# EAGLE design commander (EAGLE 5.03)
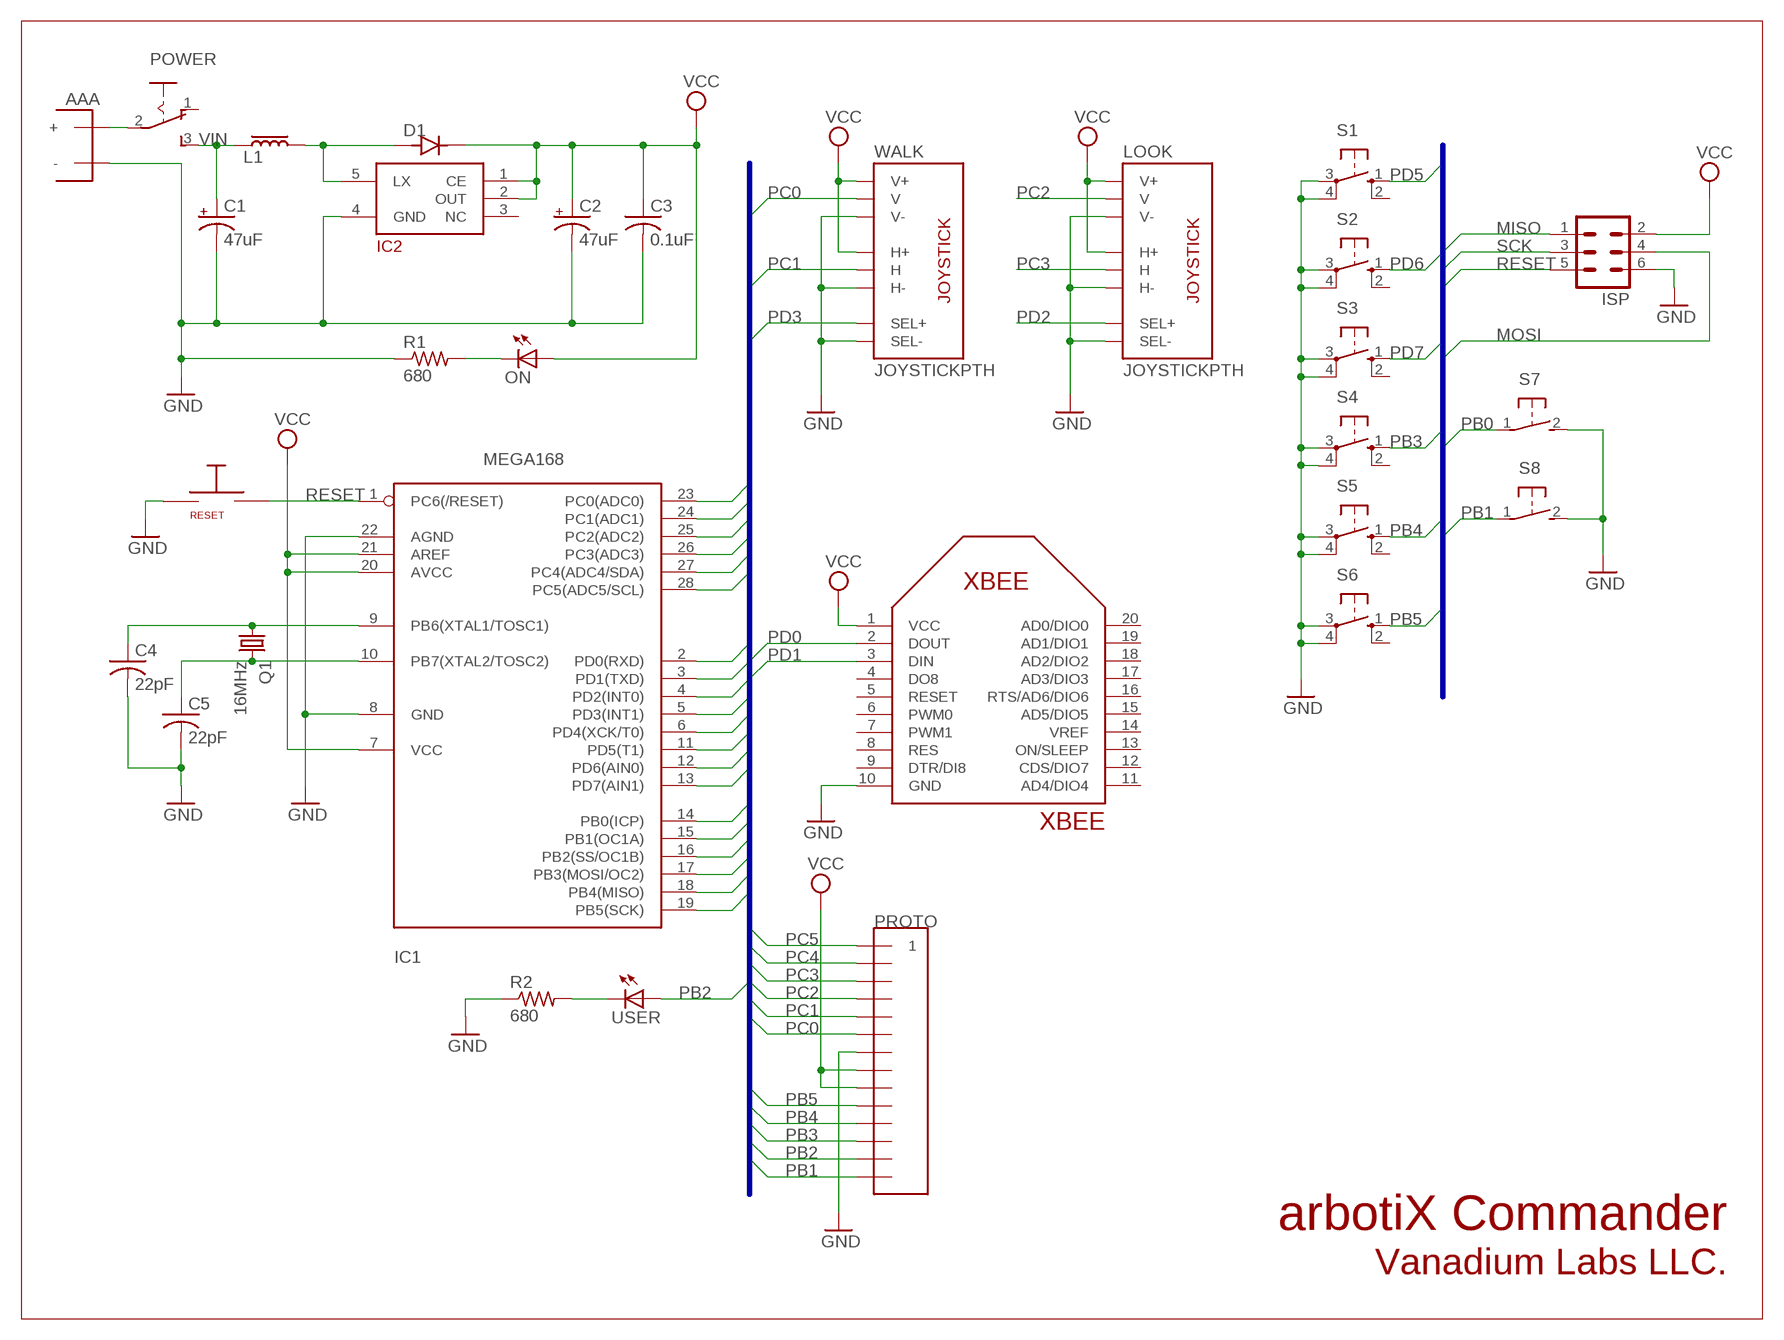
[diagram p0: schematic, sheet 1]

## Parts
C1  47uF  CPOL-USTT2D5  [TT2D5]
C2  47uF  CPOL-USTT2D5  [TT2D5]
C3  0.1uF  C-US025-024X044  [C025-024X044]
C4  22pF  C-US025-024X044  [C025-024X044]
C5  22pF  C-US025-024X044  [C025-024X044]
D1  DFLS130  [POWERDI123]
IC1  MEGA168  MEGA8-P  [DIL28-3]
IC2  NCP1402  [SOT-23-5]
ISP  MA03-2  [MA03-2]
L1  811-1293-ND  [2200R]
LOOK  JOYSTICKPTH  [JOYSTICK]
ON  LED3MM  [LED3MM]
POWER  M251  [M251]
Q1  16MHz  HC49/S  [HC49/S]
R1  680  R-US_0204/7  [0204/7]
R2  680  R-US_0204/7  [0204/7]
RESET  400-1646-ND  [MINISW]
S1  10-XX  [B3F-10XX]
S2  10-XX  [B3F-10XX]
S3  10-XX  [B3F-10XX]
S4  10-XX  [B3F-10XX]
S5  10-XX  [B3F-10XX]
S6  10-XX  [B3F-10XX]
S7  31-XX  [B3F-31XX]
S8  31-XX  [B3F-31XX]
U$1  HEADER14  [1X14]
U$2  AAA  [AAA]
USER  LED3MM  [LED3MM]
WALK  JOYSTICKPTH  [JOYSTICK]
XBEE  XBEE  [XBEE]

## Nets
GND: C1.- C2.- C3.2 C4.2 C5.2 IC1.8(GND) IC1.22(AGND) IC2.4(GND) ISP.6 LOOK.B2A(SEL-) LOOK.H3(H-) LOOK.V3(V-) R1.1 R2.1 RESET.2 S1.3(P) S1.4(P1) S2.3(P) S2.4(P1) S3.3(P) S3.4(P1) S4.3(P) S4.4(P1) S5.3(P) S5.4(P1) S6.3(P) S6.4(P1) S7.2(S) S8.2(S) U$1.P$7 U$2.P$2(-) WALK.B2A(SEL-) WALK.H3(H-) WALK.V3(V-) XBEE.10(GND)
N$3: ON.K(C) R1.2
N$6: C4.1 IC1.9(PB6(XTAL1/TOSC1)) Q1.1
N$7: C5.1 IC1.10(PB7(XTAL2/TOSC2)) Q1.2
N$55: D1.ANODE IC2.5(LX) L1.P$2
N$56: POWER.2(P) U$2.P$1(+)
PB0: IC1.14(PB0(ICP)) S7.1(P)
PB1: IC1.15(PB1(OC1A)) S8.1(P) U$1.P$14
PB2: IC1.16(PB2(SS/OC1B)) U$1.P$13 USER.A
PB3: IC1.17(PB3(MOSI/OC2)) ISP.4 S4.1(S) U$1.P$12
PB4: IC1.18(PB4(MISO)) ISP.1 S5.1(S) U$1.P$11
PB5: IC1.19(PB5(SCK)) ISP.3 S6.1(S) U$1.P$10
PC0: IC1.23(PC0(ADC0)) U$1.P$6 WALK.V2(V)
PC1: IC1.24(PC1(ADC1)) U$1.P$5 WALK.H2(H)
PC2: IC1.25(PC2(ADC2)) LOOK.V2(V) U$1.P$4
PC3: IC1.26(PC3(ADC3)) LOOK.H2(H) U$1.P$3
PC4: IC1.27(PC4(ADC4/SDA)) U$1.P$2
PC5: IC1.28(PC5(ADC5/SCL)) U$1.P$1
PD0: IC1.2(PD0(RXD)) XBEE.2(DOUT)
PD1: IC1.3(PD1(TXD)) XBEE.3(DIN)
PD2: IC1.4(PD2(INT0)) LOOK.B1A(SEL+)
PD3: IC1.5(PD3(INT1)) WALK.B1A(SEL+)
PD4: IC1.6(PD4(XCK/T0))
PD5: IC1.11(PD5(T1)) S1.1(S)
PD6: IC1.12(PD6(AIN0)) S2.1(S)
PD7: IC1.13(PD7(AIN1)) S3.1(S)
RESET: IC1.1(PC6(/RESET)) ISP.5 RESET.1
USER: R2.2 USER.K(C)
VCC: C2.+ C3.1 D1.CATHODE IC1.7(VCC) IC1.20(AVCC) IC1.21(AREF) IC2.1(CE) IC2.2(OUT) ISP.2 LOOK.H1(H+) LOOK.V1(V+) ON.A U$1.P$8 U$1.P$9 WALK.H1(H+) WALK.V1(V+) XBEE.1(VCC)
VIN: C1.+ L1.P$1 POWER.3(S)
Unconnected: IC2.3(NC) POWER.1(O) S1.2(S1) S2.2(S1) S3.2(S1) S4.2(S1) S5.2(S1) S6.2(S1) XBEE.4(DO8) XBEE.5(RESET) XBEE.6(PWM0) XBEE.7(PWM1) XBEE.8(RES) XBEE.9(DTR/DI8) XBEE.11(AD4/DIO4) XBEE.12(CDS/DIO7) XBEE.13(ON/SLEEP) XBEE.14(VREF) XBEE.15(AD5/DIO5) XBEE.16(RTS/AD6/DIO6) XBEE.17(AD3/DIO3) XBEE.18(AD2/DIO2) XBEE.19(AD1/DIO1) XBEE.20(AD0/DIO0)

## Buses
PB[0..5],PC[0..5],PD[0..7],RESET

## Notes on the sheet
- AAA
- MISO
- SCK
- MOSI
- PROTO
- arbotiX Commander
- Vanadium Labs LLC.

## Library data of the parts
C1 C2 = rcl:CPOL-US: POLARIZED CAPACITOR, American symbol
C3-C5 = rcl:C-US: CAPACITOR, American symbol
D1 = robots:DFLS130
IC1 = avr:MEGA8-P: MICROCONTROLLER 8 Kbytes FLASH 1 kbytes SRAM 512 bytes EEPROM USART 4-channel 10 bit ADC 2-channel 8 bit ADC
IC2 = robots:NCP1402
ISP = con-lstb:MA03-2: PIN HEADER
L1 = robots:811-1293-ND
LOOK WALK = SparkFun:JOYSTICK: Thumb Joystick Joystick commonly found in PS2 controllers. Two pots and a select switch. Footprint proven. Spark Fun Electronics SKU : COM-09032
ON USER = led:LED: LED OSRAM: - CHIPLED LG R971, LG N971, LY N971, LG Q971, LY Q971, LO R971, LY R971 LH N974, LH R974 LS Q976, LO Q976, LY Q976 LO Q996 - Hyper CHIPLED LW Q18S LB Q993, LB Q99A, LB R99A - SideLED LS A670, LO A670, LY A670, LG A670, LP A670 LB A673, LV A673, LT A673, LW A673 LH A674 LY A675 LS A676, LA A676, LO A676, LY A676, LW A676 LS A679, LY A679, LG A679 - Hyper Micro SIDELED® LS Y876, LA Y876, LO Y876, LY Y876 LT Y87S - SmartLED LW L88C, LW L88S LB L89C, LB L89S, LG L890 LS L89K, LO L89K, LY L89K LS L896, LA L896, LO L896, LY L896 - TOPLED LS T670, LO T670, LY T670, LG T670, LP T670 LSG T670, LSP T670, LSY T670, LOP T670, LYG T670 LG T671, LOG T671, LSG T671 LB T673, LV T673, LT T673, LW T673 LH T674 LS T676, LA T676, LO T676, LY T676, LB T676, LH T676, LSB T676, LW T676 LB T67C, LV T67C, LT T67C, LS T67K, LO T67K, LY T67K, LW E67C LS E67B, LA E67B, LO E67B, LY E67B, LB E67C, LV E67C, LT E67C LW T67C LS T679, LY T679, LG T679 LS T770, LO T770, LY T770, LG T770, LP T770 LB T773, LV T773, LT T773, LW T773 LH T774 LS E675, LA E675, LY E675, LS T675 LS T776, LA T776, LO T776, LY T776, LB T776 LHGB T686 LT T68C, LB T68C - Hyper Mini TOPLED® LB M676 - Mini TOPLED Santana® LG M470 LS M47K, LO M47K, LY M47K Source: http://www.osram.convergy.de LUXEON: - LUMILED® LXK2-PW12-R00, LXK2-PW12-S00, LXK2-PW14-U00, LXK2-PW14-V00 LXK2-PM12-R00, LXK2-PM12-S00, LXK2-PM14-U00 LXK2-PE12-Q00, LXK2-PE12-R00, LXK2-PE12-S00, LXK2-PE14-T00, LXK2-PE14-U00 LXK2-PB12-K00, LXK2-PB12-L00, LXK2-PB12-M00, LXK2-PB14-N00, LXK2-PB14-P00, LXK2-PB14-Q00 LXK2-PR12-L00, LXK2-PR12-M00, LXK2-PR14-Q00, LXK2-PR14-R00 LXK2-PD12-Q00, LXK2-PD12-R00, LXK2-PD12-S00 LXK2-PH12-R00, LXK2-PH12-S00 LXK2-PL12-P00, LXK2-PL12-Q00, LXK2-PL12-R00 Source: www.luxeon.com KINGBRIGHT: KA-3528ASYC Source: www.kingbright.com
POWER = switch:M251: SLIDING SWITCH Mors, distributor Buerklin, 11G702
Q1 = crystal:HC49/S: CRYSTAL
R1 R2 = rcl:R-US_: RESISTOR, American symbol
RESET = robots:400-1646-ND: Mini Switch
S1-S6 = switch-omron:10-XX: OMRON SWITCH
S7 S8 = switch-omron:31-XX: OMRON SWITCH
U$1 = robots:HEADER14
U$2 = robots:AAA
XBEE = robots:XBEE

## Board
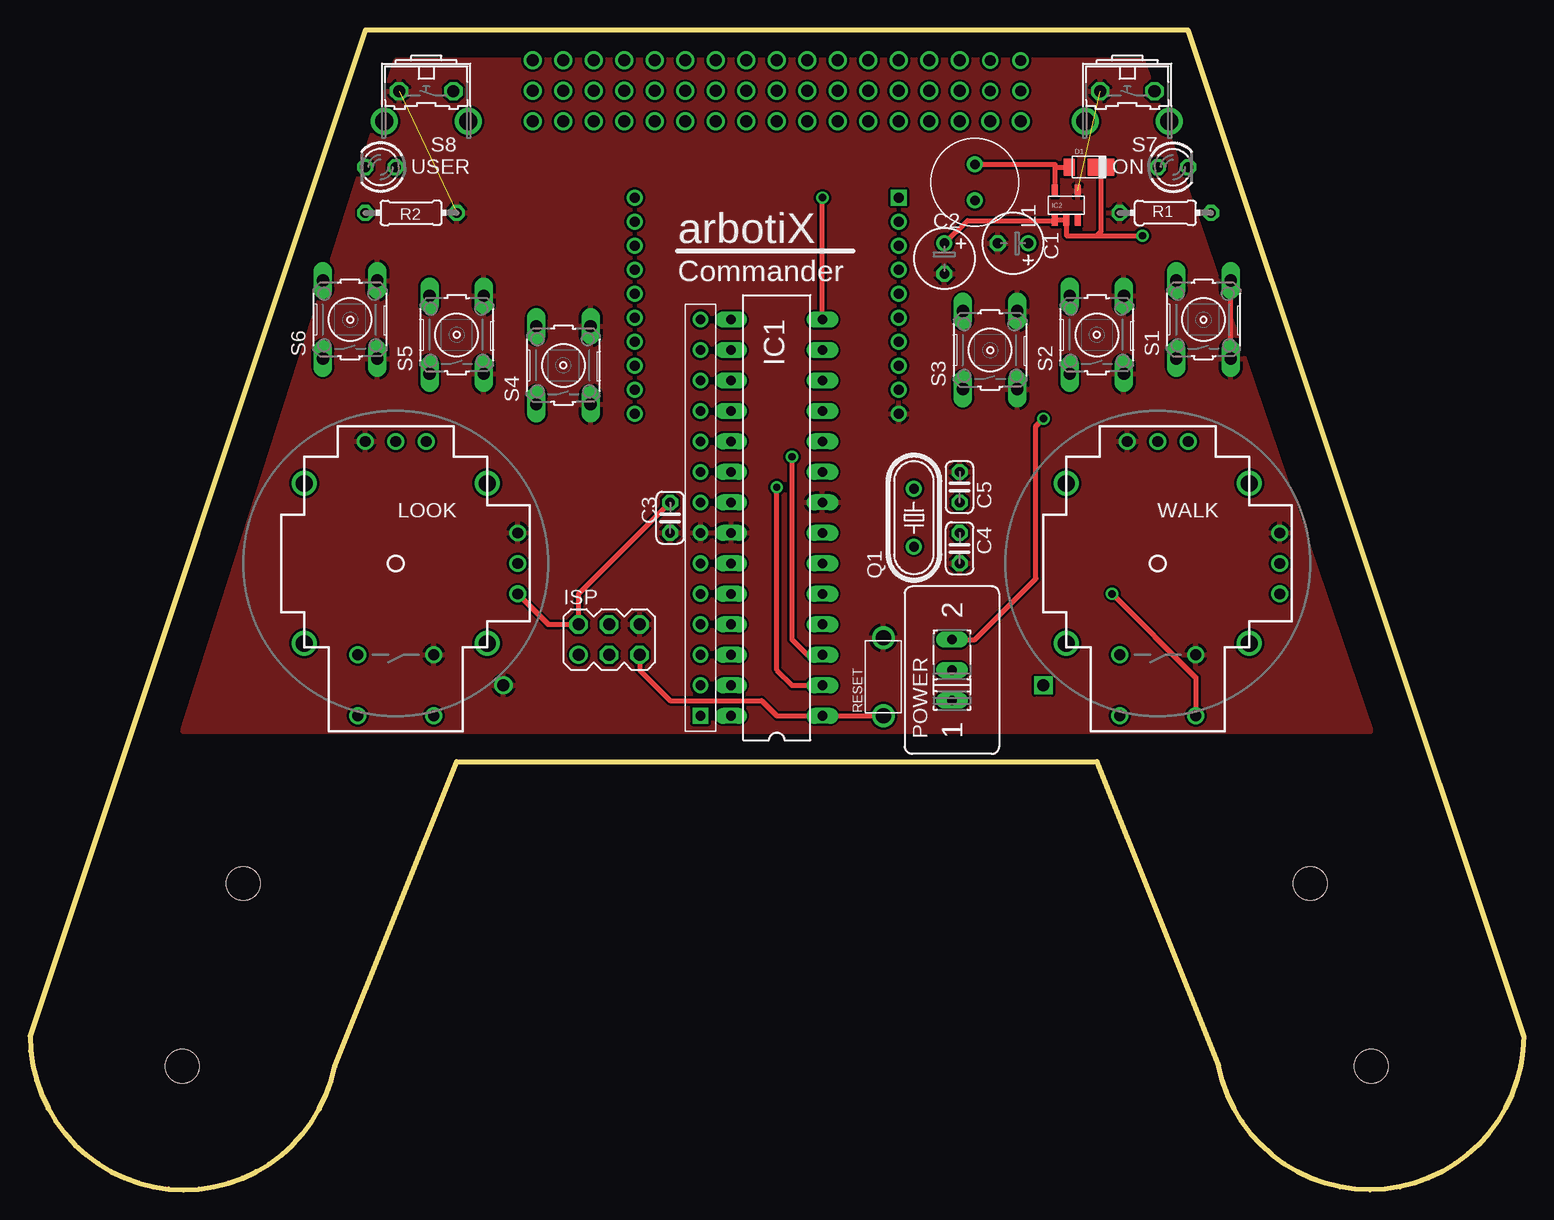
[diagram p1: board, top side]
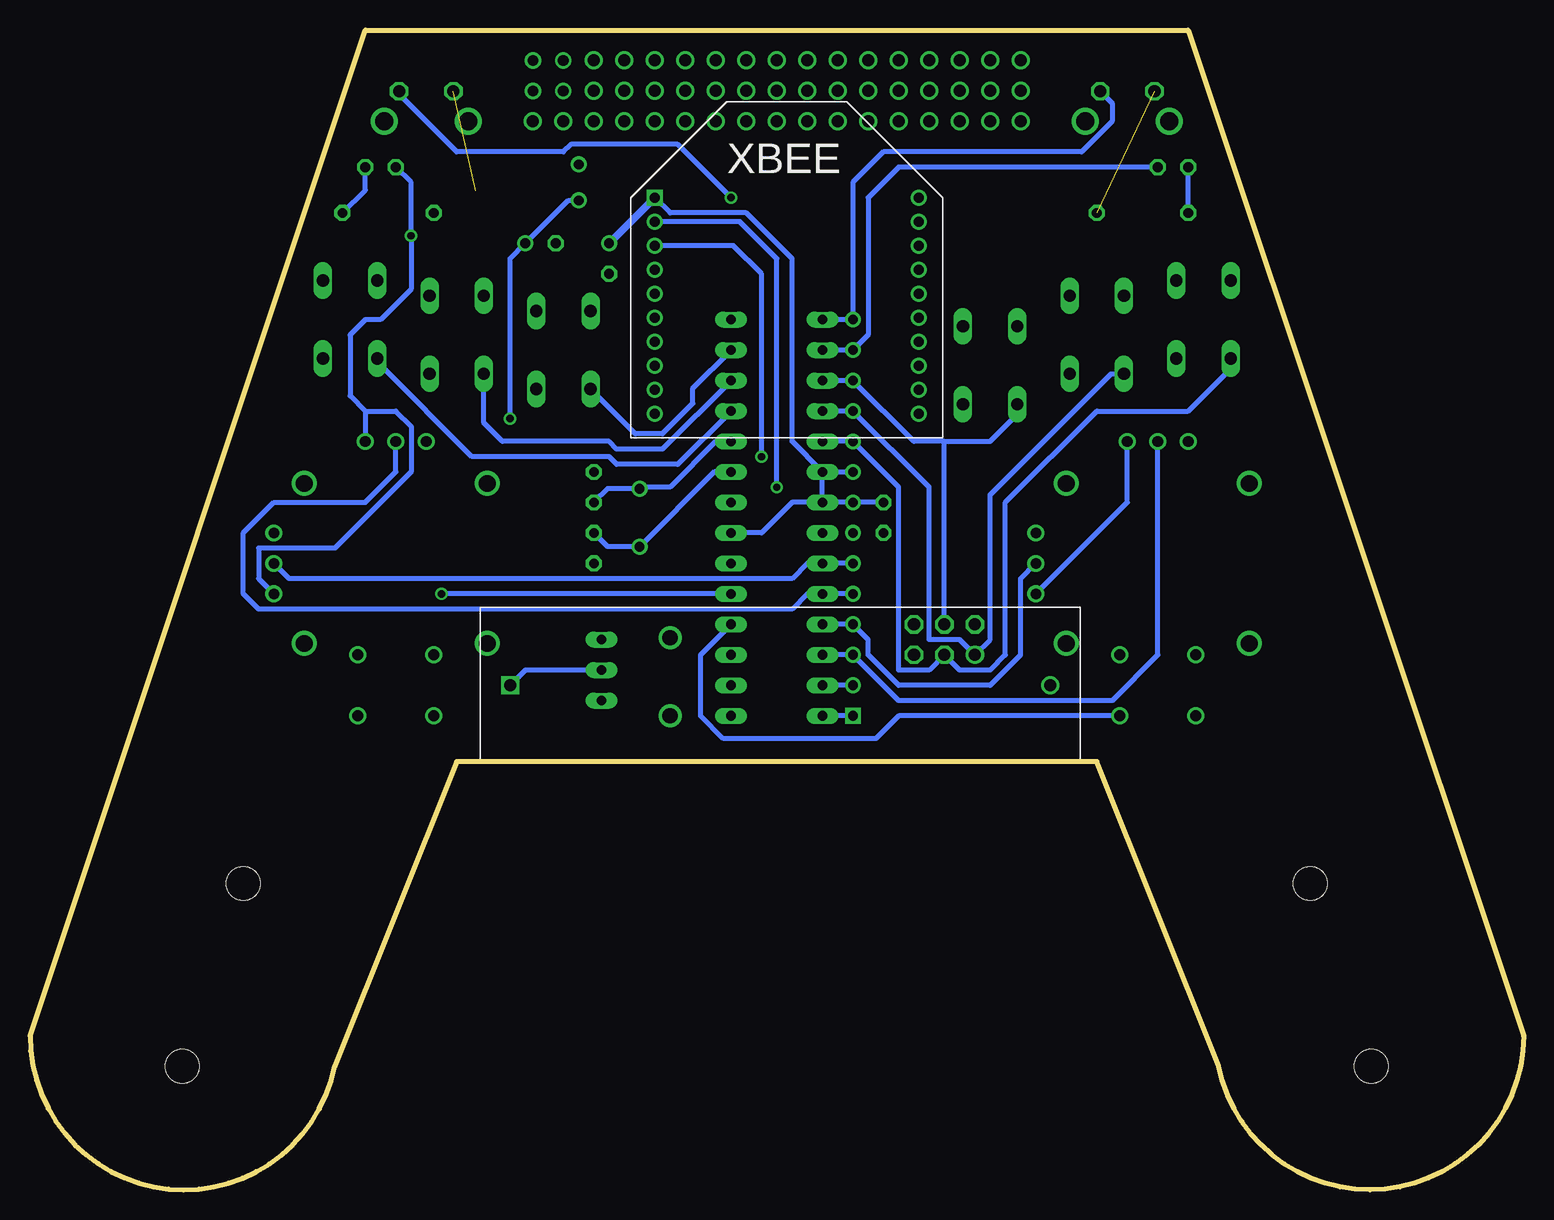
[diagram p2: board, bottom side, seen from below]

Size 124.46 x 96.65 mm. Coordinates in mm from the lower left corner, seen from the top.
Outline: 124.46,12.83 96.52,96.65 27.94,96.65 0,12.83 arc169 25.4,10.29 35.56,35.69 88.9,35.69 99.06,10.29 arc169 124.46,12.83
Copper layers (1*16): Top 0.035mm / dielectric 1.5mm / Bottom 0.035mm
Design rules "default": minimum track width 10mil, minimum drill 24mil, track to track 8mil, track to pad 8mil, pad to pad 8mil, via to via 8mil, smd to smd 8mil, copper to edge 40mil, drill to drill 8mil, minimum pad ring 10mil, minimum via ring 8mil, stop-mask expansion 4mil, vias tented up to drill 0mil, thermal gap 10mil
Holes 2.8 mm at 17.78,25.53 12.7,10.29 106.68,25.53 111.76,10.29

### Footprints (pad centres in the part's own frame; a part is rotated, then mirrored left to right if it is on the bottom)
TT2D5 = drill 0.813 round: + -1.27,0 | drill 0.813 octagon: - 1.27,0
C025-024X044 = drill 0.813 octagon: 1 -1.27,0; 2 1.27,0
POWERDI123 = smd 0.9 x 1.4: ANODE -1.65,0 | smd 2.2 x 1.4: CATHODE 1,0
DIL28-3 = drill 0.813 long: 1 -16.51,-3.81; 2 -13.97,-3.81; 3 -11.43,-3.81; 4 -8.89,-3.81; 5 -6.35,-3.81; 6 -3.81,-3.81; 7 -1.27,-3.81; 8 1.27,-3.81; 9 3.81,-3.81; 10 6.35,-3.81; 11 8.89,-3.81; 12 11.43,-3.81; 13 13.97,-3.81; 14 16.51,-3.81; 15 16.51,3.81; 16 13.97,3.81; 17 11.43,3.81; 18 8.89,3.81; 19 6.35,3.81; 20 3.81,3.81; 21 1.27,3.81; 22 -1.27,3.81; 23 -3.81,3.81; 24 -6.35,3.81; 25 -8.89,3.81; 26 -11.43,3.81; 27 -13.97,3.81; 28 -16.51,3.81
SOT-23-5 = smd 0.508 x 1.016: 1 -0.95,-1.2; 2 0,-1.2; 3 0.95,-1.2; 4 0.95,1.2; 5 -0.95,1.2
MA03-2 = drill 1.016 round: 1 -2.54,-1.27 | drill 1.016 octagon: 2 -2.54,1.27; 3 0,-1.27; 4 0,1.27; 5 2.54,-1.27; 6 2.54,1.27
2200R = drill 0.813 round: P$1 -1.5,0; P$2 1.5,0
JOYSTICK = drill 0.9 round: B1A -3.175,12.7; B1B 3.175,12.7; B2A -3.175,7.62; B2B 3.175,7.62 | drill 0.889 round: H1 -2.54,-10.16; H2 0,-10.16; H3 2.54,-10.16; V1 -10.16,2.54; V2 -10.16,0; V3 -10.16,-2.54 | drill 1.397 round: MOUNT1 -7.62,6.668; MOUNT2 -7.62,-6.668; MOUNT3 7.62,-6.668; MOUNT4 7.62,6.668
LED3MM = drill 0.813 octagon: A -1.27,0; K 1.27,0
M251 = drill 0.813 long: 1 -2.54,0; 2 0,0; 3 2.54,0
HC49/S = drill 0.813 round: 1 -2.413,0; 2 2.413,0
0204/7 = drill 0.813 octagon: 1 -3.81,0; 2 3.81,0
MINISW = drill 1.27 round: 1 0,0; 2 6.5,0
B3F-10XX = drill 1.016 long: 1 -3.251,2.261; 2 3.251,2.261; 3 -3.251,-2.261; 4 3.251,-2.261
B3F-31XX = drill 1.016 octagon: 1 -2.261,-1.245; 2 2.261,-1.245 | drill 1.499 pad 2.159 round: 3 -3.505,1.245; 4 3.505,1.245
1X14 = drill 0.813 square: P$1 0,0 | drill 0.813 round: P$2 2.54,0; P$3 5.08,0; P$4 7.62,0; P$5 10.16,0; P$6 12.7,0; P$7 15.24,0; P$8 17.78,0; P$9 20.32,0; P$10 22.86,0; P$11 25.4,0; P$12 27.94,0; P$13 30.48,0; P$14 33.02,0
AAA = drill 1 square: P$1 0,0 | drill 1 round: P$2 45,0
XBEE = drill 0.813 square: 1 0,0 | drill 0.813 round: 2 0,-2; 3 0,-4; 4 0,-6; 5 0,-8; 6 0,-10; 7 0,-12; 8 0,-14; 9 0,-16; 10 0,-18; 11 22,-18; 12 22,-16; 13 22,-14; 14 22,-12; 15 22,-10; 16 22,-8; 17 22,-6; 18 22,-4; 19 22,-2; 20 22,0

### Placement (x,y rotation side)
C1  81.91,78.87 180 top
C2  76.2,77.6 270 top
C3  53.34,56.01 270 top
C4  77.47,53.47 270 top
C5  77.47,58.55 90 top
D1  88.27,85.22 0 top
IC1  62.23,56.01 90 top
IC2  86.36,82.04 0 top
ISP  48.26,45.85 0 top
L1  78.74,83.95 90 top
LOOK  30.48,52.2 180 top
ON  95.25,85.22 0 top
POWER  76.83,43.31 90 top
Q1  73.66,56.01 90 top
R1  94.61,81.41 0 top
R2  31.75,81.41 180 top
RESET  71.12,39.5 90 top
S1  97.79,72.52 90 top
S2  88.9,71.25 90 top
S3  80.01,69.98 90 top
S4  44.45,68.71 90 top
S5  35.56,71.25 90 top
S6  26.67,72.52 90 top
S7  91.44,90.3 180 top
S8  33.02,90.3 180 top
U$1  55.88,39.5 90 top
U$2  84.45,42.04 0 bottom
USER  29.21,85.22 180 top
WALK  93.98,52.2 180 top
XBEE  72.39,82.68 0 bottom

### Tracks (layer width: path | path; a pad name or v marks a point on that pad's centre or on a via)
GND  (2 unrouted)
  Top 0.406: S1.3 S1.4
  pour Top: 12.7,38.23 111.76,38.23 92.71,94.11 30.48,94.11
N$1  (via drill 1)
  other vias: 41.91,91.57
N$2  (via drill 1)
  other vias: 41.91,94.11
N$3
  Bottom 0.406: R1.2 96.52,83.31 ON.K
N$4  (via drill 1)
  other vias: 44.45,94.11
N$5  (via drill 1)
  other vias: 46.99,94.11
N$6
  Bottom 0.406: IC1.9 67.44,59.82 Q1.1 76.33,53.59 C4.1
N$7
  Bottom 0.406: IC1.10 67.31,62.36 71.12,58.55 73.53,58.55 Q1.2 76.33,58.42 C5.1
N$8  (via drill 1)
  other vias: 49.53,94.11
N$9  (via drill 1)
  other vias: 52.07,94.11
N$10  (via drill 1)
  other vias: 54.61,94.11
N$11  (via drill 1)
  other vias: 57.15,94.11
N$12  (via drill 1)
  other vias: 59.69,94.11
N$13  (via drill 1)
  other vias: 62.23,94.11
N$14  (via drill 1)
  other vias: 62.23,91.57
N$15  (via drill 1)
  other vias: 62.23,89.03
N$16  (via drill 1)
  other vias: 64.77,89.03
N$17  (via drill 1)
  other vias: 64.77,91.57
N$18  (via drill 1)
  other vias: 64.77,94.11
N$19  (via drill 1)
  other vias: 67.31,94.11
N$20  (via drill 1)
  other vias: 69.85,94.11
N$21  (via drill 1)
  other vias: 72.39,94.11
N$22  (via drill 1)
  other vias: 74.93,94.11
N$23  (via drill 1)
  other vias: 77.47,94.11
N$24  (via drill 0.9)
  other vias: 80.01,91.57
N$25  (via drill 0.9)
  other vias: 80.01,94.11
N$26  (via drill 0.9)
  other vias: 82.55,91.57
N$27  (via drill 1)
  other vias: 82.55,89.03
N$28  (via drill 1)
  other vias: 80.01,89.03
N$29  (via drill 0.9)
  other vias: 82.55,94.11
N$30  (via drill 1)
  other vias: 77.47,91.57
N$31  (via drill 1)
  other vias: 77.47,89.03
N$32  (via drill 1)
  other vias: 74.93,89.03
N$33  (via drill 1)
  other vias: 74.93,91.57
N$34  (via drill 1)
  other vias: 72.39,91.57
N$35  (via drill 1)
  other vias: 72.39,89.03
N$36  (via drill 1)
  other vias: 69.85,89.03
N$37  (via drill 1)
  other vias: 69.85,91.57
N$38  (via drill 1)
  other vias: 67.31,91.57
N$39  (via drill 1)
  other vias: 67.31,89.03
N$40  (via drill 1)
  other vias: 41.91,89.03
N$41  (via drill 1)
  other vias: 44.45,91.57
N$42  (via drill 1)
  other vias: 44.45,89.03
N$43  (via drill 1)
  other vias: 46.99,89.03
N$44  (via drill 1)
  other vias: 46.99,91.57
N$45  (via drill 1)
  other vias: 49.53,91.57
N$46  (via drill 1)
  other vias: 49.53,89.03
N$47  (via drill 1)
  other vias: 52.07,89.03
N$48  (via drill 1)
  other vias: 52.07,91.57
N$49  (via drill 1)
  other vias: 54.61,91.57
N$50  (via drill 1)
  other vias: 54.61,89.03
N$51  (via drill 1)
  other vias: 57.15,89.03
N$52  (via drill 1)
  other vias: 57.15,91.57
N$53  (via drill 1)
  other vias: 59.69,91.57
N$54  (via drill 1)
  other vias: 59.69,89.03
N$55
  Top 0.406: 85.41,85.22 IC2.5 | 85.41,85.22 D1.ANODE | L1.P$2 85.41,85.45 85.41,85.22
N$56
  Bottom 0.406: POWER.2 83.19,43.31 U$2.P$1
PB0  (via drill 0.61)
  Top 0.406: IC1.14 v66.04,82.68
  Bottom 0.406: S7.1 93.7,91.29 88.9,86.49 80.01,86.49 79.38,87.12 70.48,87.12 v66.04,82.68
PB1
  Bottom 0.406: IC1.15 U$1.P$14 55.88,83.95 53.34,86.49 36.83,86.49 34.29,89.03 34.29,90.55 S8.1
PB2
  Bottom 0.406: IC1.16 U$1.P$13 54.61,71.25 54.61,82.68 52.07,85.22 USER.A
PB3
  Bottom 0.406: 48.26,62.36 50.8,62.36 U$1.P$12 IC1.17 | ISP.4 48.26,62.36 | S4.1 42.19,64.62 44.45,62.36 48.26,62.36
PB4
  Bottom 0.406: S5.1 34.37,68 44.45,57.91 44.45,45.85 ISP.1 46.99,45.85 49.53,45.85 49.53,58.55 U$1.P$11 IC1.18
PB5
  Bottom 0.406: IC1.19 U$1.P$10 52.07,58.55 52.07,43.31 49.53,43.31 ISP.3 46.99,43.31 44.45,43.31 43.18,44.58 43.18,57.28 35.56,64.9 27.94,64.9 24.41,68.43 S6.1
PC0
  Bottom 0.406: WALK.V2 102.87,50.93 60.96,50.93 59.69,52.2 IC1.23 U$1.P$6
PC1
  Bottom 0.406: WALK.H2 93.98,59.82 96.52,57.28 104.14,57.28 106.68,54.74 106.68,49.66 105.41,48.39 60.96,48.39 59.69,49.66 IC1.24 U$1.P$5
PC2
  Bottom 0.406: LOOK.V2 41.91,50.93 41.91,44.58 44.45,42.04 52.07,42.04 54.61,44.58 54.61,45.85 U$1.P$4 IC1.25
PC3
  Bottom 0.406: LOOK.H2 30.48,44.58 34.29,40.77 52.07,40.77 U$1.P$3 IC1.26
PC4
  Bottom 0.406: U$1.P$2 IC1.27
PC5
  Bottom 0.406: U$1.P$1 IC1.28
PD0  (via drill 0.61)
  Top 0.406: IC1.2 63.5,42.04 62.23,43.31 v62.23,58.55
  Bottom 0.406: v62.23,58.55 62.23,77.6 65.31,80.68 XBEE.2
PD1  (via drill 0.61)
  Top 0.406: v63.5,61.09 63.5,45.85 64.77,44.58 IC1.3
  Bottom 0.406: XBEE.3 65.85,78.68 63.5,76.33 v63.5,61.09
PD2
  Bottom 0.406: LOOK.B1A 52.07,39.5 53.98,37.59 66.67,37.59 68.58,39.5 68.58,44.58 IC1.4
PD3  (via drill 0.61)
  Top 0.406: WALK.B1A 97.16,42.67 v90.17,49.66
  Bottom 0.406: IC1.5 v90.17,49.66
PD5
  Bottom 0.406: IC1.11 70.48,60.45 75.56,60.45 76.2,61.09 87.63,61.09 95.25,68.71 95.25,68.99 S1.1
PD6
  Bottom 0.406: S2.1 86.64,63.91 85.09,62.36 76.2,62.36 75.56,61.72 71.75,61.72 IC1.12
PD7
  Bottom 0.406: IC1.13 69.22,66.8 69.22,65.53 71.75,62.99 74.02,62.99 S3.1
RESET
  Top 0.406: RESET.1 IC1.1 62.23,39.5 60.96,40.77 53.34,40.77 50.8,43.31 ISP.5
USER
  Bottom 0.406: R2.2 USER.K
VCC  (via drill 0.61)
  Top 0.406: LOOK.V1 43.18,47.12 ISP.2 45.72,49.66 C3.1 | 88.9,79.5 86.36,79.5 IC2.2 IC2.1 85.34,80.77 78.11,80.77 C2.+ | 88.9,79.5 v92.71,79.5 | D1.CATHODE 89.27,79.87 88.9,79.5
  Bottom 0.406: IC1.7 63.5,54.74 60.96,57.28 IC1.21 | IC1.21 IC1.20 | IC1.20 U$1.P$9 | IC1.21 U$1.P$8 C3.1 | ON.A 92.71,83.95 v92.71,79.5 92.71,75.06 95.25,72.52 96.52,72.52 97.79,71.25 97.79,66.17 96.52,64.9 | LOOK.H1 33.02,57.28 LOOK.V1 | WALK.V1 105.41,50.93 105.41,53.47 99.06,53.47 92.71,59.82 92.71,63.63 93.98,64.9 96.52,64.9 | 96.52,64.9 WALK.H1 | XBEE.1 71.12,81.41 64.77,81.41 60.96,77.6 60.96,62.36 IC1.20
  Bottom 0.61: XBEE.1 C2.+
VIN  (via drill 0.61)
  Top 0.406: v84.45,64.26 83.82,63.63 83.82,50.93 78.74,45.85 POWER.3
  Bottom 0.406: v84.45,64.26 84.45,77.6 C1.+ 79.61,82.45 L1.P$1

### Text on the board
tPlace: Commander
tNames: arbotiX